# EAGLE schematic BRD1001-002-320 - Switching Register (EAGLE 9.4.2)
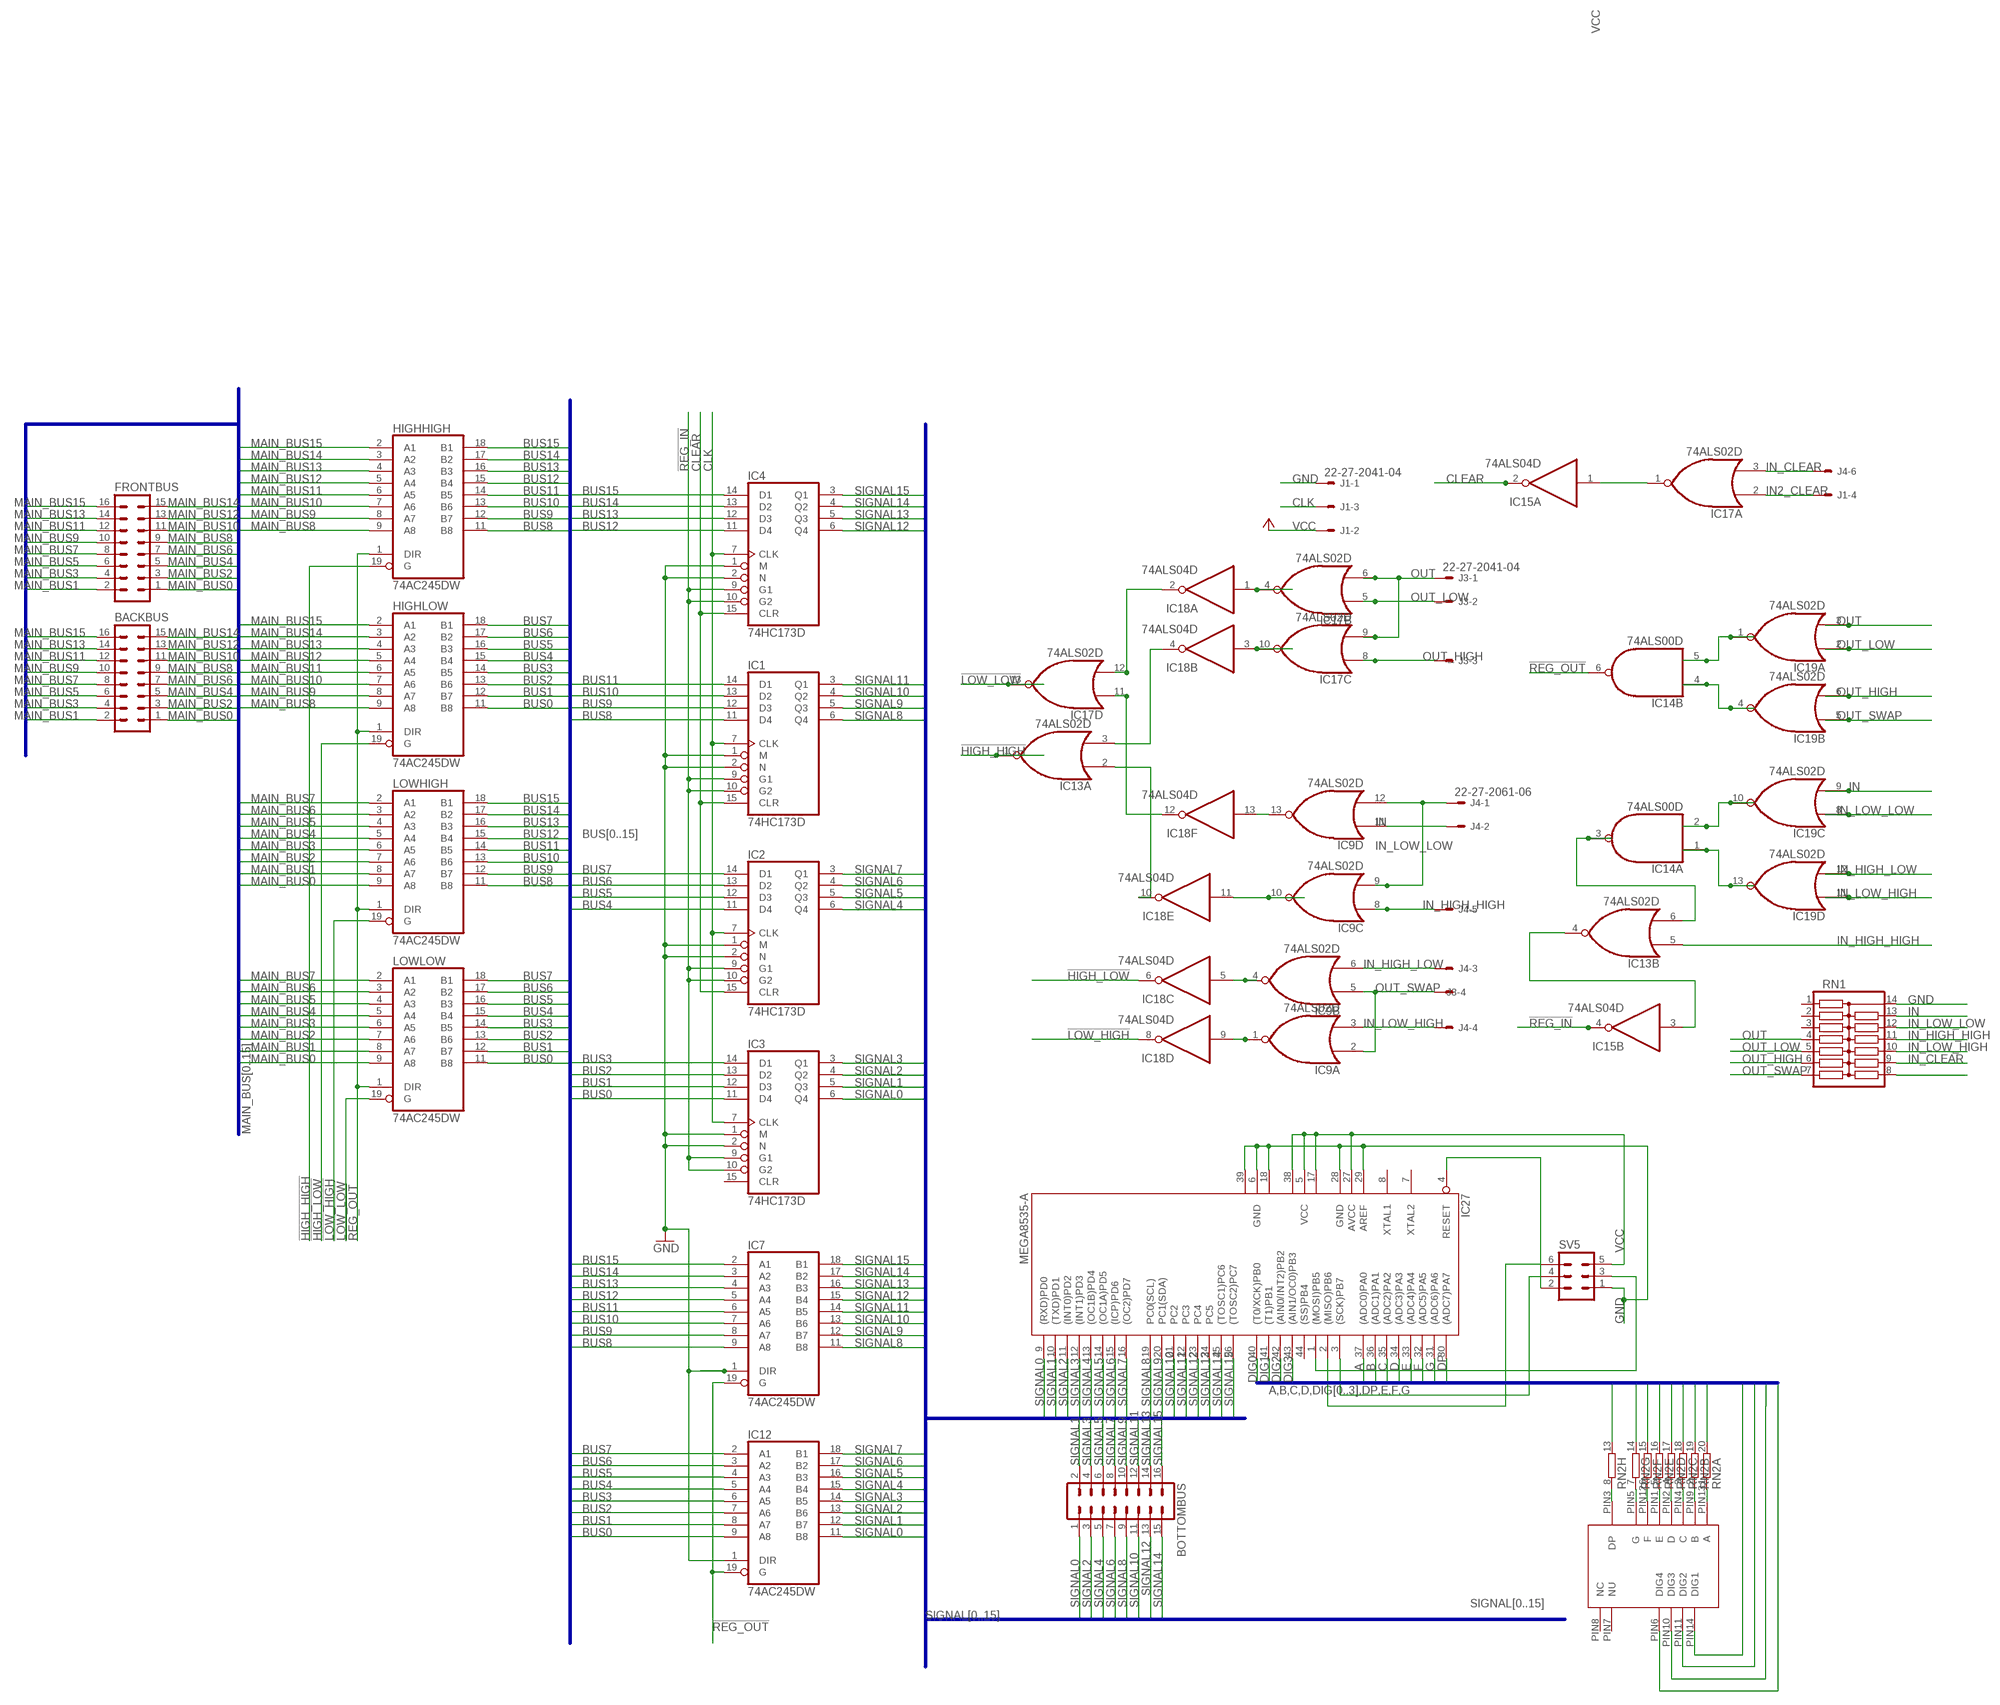
[diagram p0: schematic, sheet 1]

## Parts
BACKBUS  ML16  [ML16]
BOTTOMBUS  ML16  [ML16]
FRONTBUS  ML16  [ML16]
HIGHHIGH  74AC245DW  [SO20W]
HIGHLOW  74AC245DW  [SO20W]
IC1  74HC173D  [SO16]
IC2  74HC173D  [SO16]
IC3  74HC173D  [SO16]
IC4  74HC173D  [SO16]
IC7  74AC245DW  [SO20W]
IC9  74ALS02D  [SO14]
IC12  74AC245DW  [SO20W]
IC13  74ALS02D  [SO14]
IC14  74ALS00D  [SO14]
IC15  74ALS04D  [SO14]
IC17  74ALS02D  [SO14]
IC18  74ALS04D  [SO14]
IC19  74ALS02D  [SO14]
IC27  MEGA8535-A  [TQFP44]
J1  22-27-2041-04  [6410-04]
J3  22-27-2041-04  [6410-04]
J4  22-27-2061-06  [6410-06]
LOWHIGH  74AC245DW  [SO20W]
LOWLOW  74AC245DW  [SO20W]
RN1  13RSOMC  [SOMC14]
RN2  10R-NSOMC  [SOMC20]
SV5  ML6  [ML6]
U$1  4-DIGIT-7-SEGMENT  [4-DIGIT-7-SEGMENT]

## Nets
!HIGH_HIGH: HIGHHIGH.19(G) IC13.1(A:O)
!HIGH_LOW: HIGHLOW.19(G) IC18.6(C:O)
!LOW_HIGH: IC18.8(D:O) LOWHIGH.19(G)
!LOW_LOW: IC17.13(D:O) LOWLOW.19(G)
!REG_IN: IC1.9(G1) IC1.10(G2) IC2.9(G1) IC2.10(G2) IC3.9(G1) IC3.10(G2) IC4.9(G1) IC4.10(G2) IC15.4(B:O)
!REG_OUT: HIGHHIGH.1(DIR) HIGHLOW.1(DIR) IC7.19(G) IC12.19(G) IC14.6(B:O) LOWHIGH.1(DIR) LOWLOW.1(DIR)
A: IC27.37((ADC0)PA0) RN2.20
B: IC27.36((ADC1)PA1) RN2.19
BUS0: HIGHLOW.11(B8) IC3.11(D4) IC12.9(A8) LOWLOW.11(B8)
BUS1: HIGHLOW.12(B7) IC3.12(D3) IC12.8(A7) LOWLOW.12(B7)
BUS2: HIGHLOW.13(B6) IC3.13(D2) IC12.7(A6) LOWLOW.13(B6)
BUS3: HIGHLOW.14(B5) IC3.14(D1) IC12.6(A5) LOWLOW.14(B5)
BUS4: HIGHLOW.15(B4) IC2.11(D4) IC12.5(A4) LOWLOW.15(B4)
BUS5: HIGHLOW.16(B3) IC2.12(D3) IC12.4(A3) LOWLOW.16(B3)
BUS6: HIGHLOW.17(B2) IC2.13(D2) IC12.3(A2) LOWLOW.17(B2)
BUS7: HIGHLOW.18(B1) IC2.14(D1) IC12.2(A1) LOWLOW.18(B1)
BUS8: HIGHHIGH.11(B8) IC1.11(D4) IC7.9(A8) LOWHIGH.11(B8)
BUS9: HIGHHIGH.12(B7) IC1.12(D3) IC7.8(A7) LOWHIGH.12(B7)
BUS10: HIGHHIGH.13(B6) IC1.13(D2) IC7.7(A6) LOWHIGH.13(B6)
BUS11: HIGHHIGH.14(B5) IC1.14(D1) IC7.6(A5) LOWHIGH.14(B5)
BUS12: HIGHHIGH.15(B4) IC4.11(D4) IC7.5(A4) LOWHIGH.15(B4)
BUS13: HIGHHIGH.16(B3) IC4.12(D3) IC7.4(A3) LOWHIGH.16(B3)
BUS14: HIGHHIGH.17(B2) IC4.13(D2) IC7.3(A2) LOWHIGH.17(B2)
BUS15: HIGHHIGH.18(B1) IC4.14(D1) IC7.2(A1) LOWHIGH.18(B1)
C: IC27.35((ADC2)PA2) RN2.18
CLEAR: IC1.15(CLR) IC2.15(CLR) IC4.15(CLR) IC15.2(A:O)
CLK: IC1.7(CLK) IC2.7(CLK) IC3.7(CLK) IC4.7(CLK) J1.3
D: IC27.34((ADC3)PA3) RN2.17
DIG0: IC27.40((T0/XCK)PB0) U$1.PIN14(DIG1)
DIG1: IC27.41((T1)PB1) U$1.PIN11(DIG2)
DIG2: IC27.42((AIN0/INT2)PB2) U$1.PIN10(DIG3)
DIG3: IC27.43((AIN1/OC0)PB3) U$1.PIN6(DIG4)
DP: IC27.30((ADC7)PA7) RN2.13
E: IC27.33((ADC4)PA4) RN2.16
F: IC27.32((ADC5)PA5) RN2.15
G: IC27.31((ADC6)PA6) RN2.14
GND: IC1.1(M) IC1.2(N) IC2.1(M) IC2.2(N) IC3.1(M) IC3.2(N) IC4.1(M) IC4.2(N) IC7.1(DIR) IC12.1(DIR) IC27.6(GND) IC27.18(GND1) IC27.28(GND) IC27.29(AREF) IC27.39(GND2) J1.1 RN1.14 SV5.1
IN: IC9.9(C:I1) IC9.12(D:I1) IC19.9(C:I1) J4.1 RN1.13
IN2_CLEAR: IC17.2(A:I0) J1.4
IN_CLEAR: IC17.3(A:I1) J4.6 RN1.9
IN_HIGH_HIGH: IC9.8(C:I0) IC13.5(B:I0) J4.5 RN1.11
IN_HIGH_LOW: IC9.6(B:I1) IC19.12(D:I1) J4.3
IN_LOW_HIGH: IC9.3(A:I1) IC19.11(D:I0) J4.4 RN1.10
IN_LOW_LOW: IC9.11(D:I0) IC19.8(C:I0) J4.2 RN1.12
MAIN_BUS0: BACKBUS.1 FRONTBUS.1 LOWHIGH.9(A8) LOWLOW.9(A8)
MAIN_BUS1: BACKBUS.2 FRONTBUS.2 LOWHIGH.8(A7) LOWLOW.8(A7)
MAIN_BUS2: BACKBUS.3 FRONTBUS.3 LOWHIGH.7(A6) LOWLOW.7(A6)
MAIN_BUS3: BACKBUS.4 FRONTBUS.4 LOWHIGH.6(A5) LOWLOW.6(A5)
MAIN_BUS4: BACKBUS.5 FRONTBUS.5 LOWHIGH.5(A4) LOWLOW.5(A4)
MAIN_BUS5: BACKBUS.6 FRONTBUS.6 LOWHIGH.4(A3) LOWLOW.4(A3)
MAIN_BUS6: BACKBUS.7 FRONTBUS.7 LOWHIGH.3(A2) LOWLOW.3(A2)
MAIN_BUS7: BACKBUS.8 FRONTBUS.8 LOWHIGH.2(A1) LOWLOW.2(A1)
MAIN_BUS8: BACKBUS.9 FRONTBUS.9 HIGHHIGH.9(A8) HIGHLOW.9(A8)
MAIN_BUS9: BACKBUS.10 FRONTBUS.10 HIGHHIGH.8(A7) HIGHLOW.8(A7)
MAIN_BUS10: BACKBUS.11 FRONTBUS.11 HIGHHIGH.7(A6) HIGHLOW.7(A6)
MAIN_BUS11: BACKBUS.12 FRONTBUS.12 HIGHHIGH.6(A5) HIGHLOW.6(A5)
MAIN_BUS12: BACKBUS.13 FRONTBUS.13 HIGHHIGH.5(A4) HIGHLOW.5(A4)
MAIN_BUS13: BACKBUS.14 FRONTBUS.14 HIGHHIGH.4(A3) HIGHLOW.4(A3)
MAIN_BUS14: BACKBUS.15 FRONTBUS.15 HIGHHIGH.3(A2) HIGHLOW.3(A2)
MAIN_BUS15: BACKBUS.16 FRONTBUS.16 HIGHHIGH.2(A1) HIGHLOW.2(A1)
N$1: IC17.4(B:O) IC18.1(A:I)
N$2: IC17.10(C:O) IC18.3(B:I)
N$3: IC14.2(A:I1) IC19.10(C:O)
N$4: IC14.1(A:I0) IC19.13(D:O)
N$5: IC15.1(A:I) IC17.1(A:O)
N$6: IC9.13(D:O) IC18.13(F:I)
N$7: IC14.5(B:I1) IC19.1(A:O)
N$8: IC14.4(B:I0) IC19.4(B:O)
N$9: IC9.10(C:O) IC18.11(E:I)
N$10: IC17.12(D:I1) IC18.2(A:O)
N$11: IC17.11(D:I0) IC18.12(F:O)
N$12: IC13.3(A:I1) IC18.4(B:O)
N$13: IC13.2(A:I0) IC18.10(E:O)
N$14: IC9.4(B:O) IC18.5(C:I)
N$15: IC9.1(A:O) IC18.9(D:I)
N$16: IC13.6(B:I1) IC14.3(A:O)
N$17: IC13.4(B:O) IC15.3(B:I)
N$18: IC27.1((MOSI)PB5) SV5.3
N$19: IC27.3((SCK)PB7) SV5.4
N$20: IC27.2((MISO)PB6) SV5.6
N$21: IC27.4(RESET) SV5.2
N$23: RN1.8
N$24: RN2.1 U$1.PIN13(A)
N$25: RN2.2 U$1.PIN9(B)
N$26: RN2.3 U$1.PIN4(C)
N$27: RN2.4 U$1.PIN2(D)
N$28: RN2.5 U$1.PIN1(E)
N$29: RN2.6 U$1.PIN12(F)
N$30: RN2.7 U$1.PIN5(G)
N$31: RN2.8 U$1.PIN3(DP)
OUT: IC17.6(B:I1) IC17.9(C:I1) IC19.3(A:I1) J3.1 RN1.4
OUT_HIGH: IC17.8(C:I0) IC19.6(B:I1) J3.3 RN1.6
OUT_LOW: IC17.5(B:I0) IC19.2(A:I0) J3.2 RN1.5
OUT_SWAP: IC9.2(A:I0) IC9.5(B:I0) IC19.5(B:I0) J3.4 RN1.7
SIGNAL0: BOTTOMBUS.1 IC3.6(Q4) IC12.11(B8) IC27.9((RXD)PD0)
SIGNAL1: BOTTOMBUS.2 IC3.5(Q3) IC12.12(B7) IC27.10((TXD)PD1)
SIGNAL2: BOTTOMBUS.3 IC3.4(Q2) IC12.13(B6) IC27.11((INT0)PD2)
SIGNAL3: BOTTOMBUS.4 IC3.3(Q1) IC12.14(B5) IC27.12((INT1)PD3)
SIGNAL4: BOTTOMBUS.5 IC2.6(Q4) IC12.15(B4) IC27.13((OC1B)PD4)
SIGNAL5: BOTTOMBUS.6 IC2.5(Q3) IC12.16(B3) IC27.14((OC1A)PD5)
SIGNAL6: BOTTOMBUS.7 IC2.4(Q2) IC12.17(B2) IC27.15((ICP)PD6)
SIGNAL7: BOTTOMBUS.8 IC2.3(Q1) IC12.18(B1) IC27.16((OC2)PD7)
SIGNAL8: BOTTOMBUS.9 IC1.6(Q4) IC7.11(B8) IC27.19(PC0(SCL))
SIGNAL9: BOTTOMBUS.10 IC1.5(Q3) IC7.12(B7) IC27.20(PC1(SDA))
SIGNAL10: BOTTOMBUS.11 IC1.4(Q2) IC7.13(B6) IC27.21(PC2)
SIGNAL11: BOTTOMBUS.12 IC1.3(Q1) IC7.14(B5) IC27.22(PC3)
SIGNAL12: BOTTOMBUS.13 IC4.6(Q4) IC7.15(B4) IC27.23(PC4)
SIGNAL13: BOTTOMBUS.14 IC4.5(Q3) IC7.16(B3) IC27.24(PC5)
SIGNAL14: BOTTOMBUS.15 IC4.4(Q2) IC7.17(B2) IC27.25((TOSC1)PC6)
SIGNAL15: BOTTOMBUS.16 IC4.3(Q1) IC7.18(B1) IC27.26((TOSC2)PC7)
VCC: IC27.5(VCC) IC27.17(VCC1) IC27.27(AVCC) IC27.38(VCC2) J1.2 SV5.5
Unconnected: IC3.15(CLR) IC13.8(C:I0) IC13.9(C:I1) IC13.10(C:O) IC13.11(D:I0) IC13.12(D:I1) IC13.13(D:O) IC14.8(C:O) IC14.9(C:I0) IC14.10(C:I1) IC14.11(D:O) IC14.12(D:I0) IC14.13(D:I1) IC15.5(C:I) IC15.6(C:O) IC15.8(D:O) IC15.9(D:I) IC15.10(E:O) IC15.11(E:I) IC15.12(F:O) IC15.13(F:I) IC27.7(XTAL2) IC27.8(XTAL1) IC27.44((SS)PB4) RN1.1 RN1.2 RN1.3 RN2.9 RN2.10 RN2.11 RN2.12 U$1.PIN7(NU) U$1.PIN8(NC)

## Buses
BUS[0..15]
SIGNAL[0..15]
MAIN_BUS[0..15]
A,B,C,D,DIG[0..3],DP,E,F,G

## Power pins joined to a net without a drawn wire
GND: HIGHHIGH.10(GND) HIGHLOW.10(GND) IC1.8(GND) IC2.8(GND) IC3.8(GND) IC4.8(GND) IC7.10(GND) IC9.7(P:GND) IC12.10(GND) IC13.7(P:GND) IC14.7(P:GND) IC15.7(P:GND) IC17.7(P:GND) IC18.7(P:GND) IC19.7(P:GND) LOWHIGH.10(GND) LOWLOW.10(GND)
VCC: HIGHHIGH.20(VCC) HIGHLOW.20(VCC) IC1.16(VCC) IC2.16(VCC) IC3.16(VCC) IC4.16(VCC) IC7.20(VCC) IC9.14(P:VCC) IC12.20(VCC) IC13.14(P:VCC) IC14.14(P:VCC) IC15.14(P:VCC) IC17.14(P:VCC) IC18.14(P:VCC) IC19.14(P:VCC) LOWHIGH.20(VCC) LOWLOW.20(VCC)

## Library data of the parts
BACKBUS BOTTOMBUS FRONTBUS = con-harting-ml:ML16: HARTING; OC_FARNELL: unknown; OC_NEWARK: unknown
HIGHHIGH HIGHLOW IC7 IC12 LOWHIGH LOWLOW = 74xx-eu:74*245: Octal BUS TRANSCEIVER, 3-state
IC1-IC4 = 74xx-eu:74*173: 4-bit D type REGISTER, 3-state
IC9 IC13 IC17 IC19 = 74xx-us:74*02: Quad 2-input NOR gate
IC14 = 74xx-us:74*00: Quad 2-input NAND gate
IC15 IC18 = 74xx-us:74*04: Hex INVERTER
IC27 = atmel:MEGA8535: MICROCONTROLLER 8 Kbytes FLASH 512 bytes SRAM 512 bytes EEPROM USART 8-channel 10 bit ADC Source: avr.lbr; MPN: ATMEGA8535-16AU; OC_FARNELL: 1528437; OC_NEWARK: 01M6908
J1 J3 = con-molex:22-?-04: CONNECTOR wire to board 2.54 mm (.1 inch) pitch header; MF: MOLEX; OC_FARNELL: unknown; OC_NEWARK: unknown
J4 = con-molex:22-?-06: CONNECTOR wire to board 2.54 mm (.1 inch) pitch header; MF: MOLEX; OC_FARNELL: unknown; OC_NEWARK: unknown
RN1 = resistor-dil:13R: DIL RESISTOR; MPN: SOMC140313R0GEJ; OC_FARNELL: unknown; OC_NEWARK: 48P4478
RN2 = resistor-dil:10R-N: DIL RESISTOR; OC_FARNELL: unknown; OC_NEWARK: unknown
SV5 = con-harting-ml:ML6: HARTING; OC_FARNELL: unknown; OC_NEWARK: unknown
U$1 = ADAFRUIT:4-DIGIT-7-SEGMENT